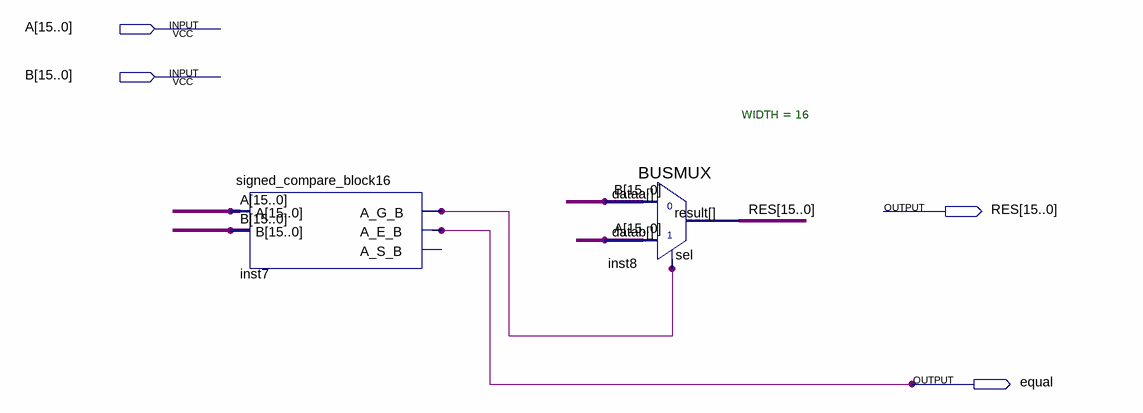
[diagram p0: schematic sheet]
// Quartus schematic ALU_comparator.bdf as structural Verilog: 2 symbols, 4 pins
module ALU_comparator (
  input  [15:0] A,
  input  [15:0] B,
  output [15:0] RES,
  output equal
);

  wire inst7_a_g_b;

  signed_compare_block16 inst7 (.A(A), .B(B), .A_G_B(inst7_a_g_b), .A_E_B(equal));  // open: A_S_B
  BUSMUX #(.WIDTH(16)) inst8 (.datab(A), .sel(inst7_a_g_b), .dataa(B), .result(RES));
endmodule
